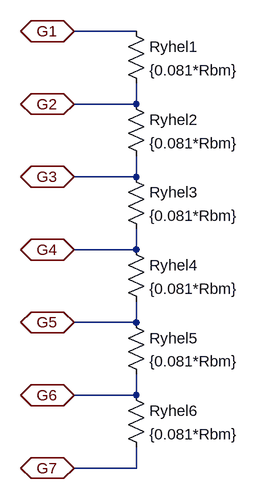
[diagram p0: schematic reseauRhel.asc]
reseauRhel.asc, the LTspice schematic file:
Version 4
SHEET 1 880 880
WIRE 64 32 -32 32
WIRE 64 144 64 112
WIRE 64 144 -32 144
WIRE 64 256 64 224
WIRE 64 256 -32 256
WIRE 64 368 64 336
WIRE 64 368 -32 368
WIRE 64 480 64 448
WIRE 64 480 -32 480
WIRE 64 592 64 560
WIRE 64 592 -32 592
WIRE 64 704 64 672
WIRE 64 704 -32 704
FLAG -32 32 G1
IOPIN -32 32 BiDir
FLAG -32 144 G2
IOPIN -32 144 BiDir
FLAG -32 256 G3
IOPIN -32 256 BiDir
FLAG -32 368 G4
IOPIN -32 368 BiDir
FLAG -32 480 G5
IOPIN -32 480 BiDir
FLAG -32 592 G6
IOPIN -32 592 BiDir
FLAG -32 704 G7
IOPIN -32 704 BiDir
SYMBOL res 48 16 R0
SYMATTR InstName Ryhel1
SYMATTR Value {0.081*Rbm}
SYMBOL res 48 128 R0
SYMATTR InstName Ryhel2
SYMATTR Value {0.081*Rbm}
SYMBOL res 48 240 R0
SYMATTR InstName Ryhel3
SYMATTR Value {0.081*Rbm}
SYMBOL res 48 352 R0
SYMATTR InstName Ryhel4
SYMATTR Value {0.081*Rbm}
SYMBOL res 48 464 R0
SYMATTR InstName Ryhel5
SYMATTR Value {0.081*Rbm}
SYMBOL res 48 576 R0
SYMATTR InstName Ryhel6
SYMATTR Value {0.081*Rbm}

The netlist it stands for:
* reseauRhel.asc
Ryhel1 G1 G2 {0.081*Rbm}
Ryhel2 G2 G3 {0.081*Rbm}
Ryhel3 G3 G4 {0.081*Rbm}
Ryhel4 G4 G5 {0.081*Rbm}
Ryhel5 G5 G6 {0.081*Rbm}
Ryhel6 G6 G7 {0.081*Rbm}
.backanno
.end